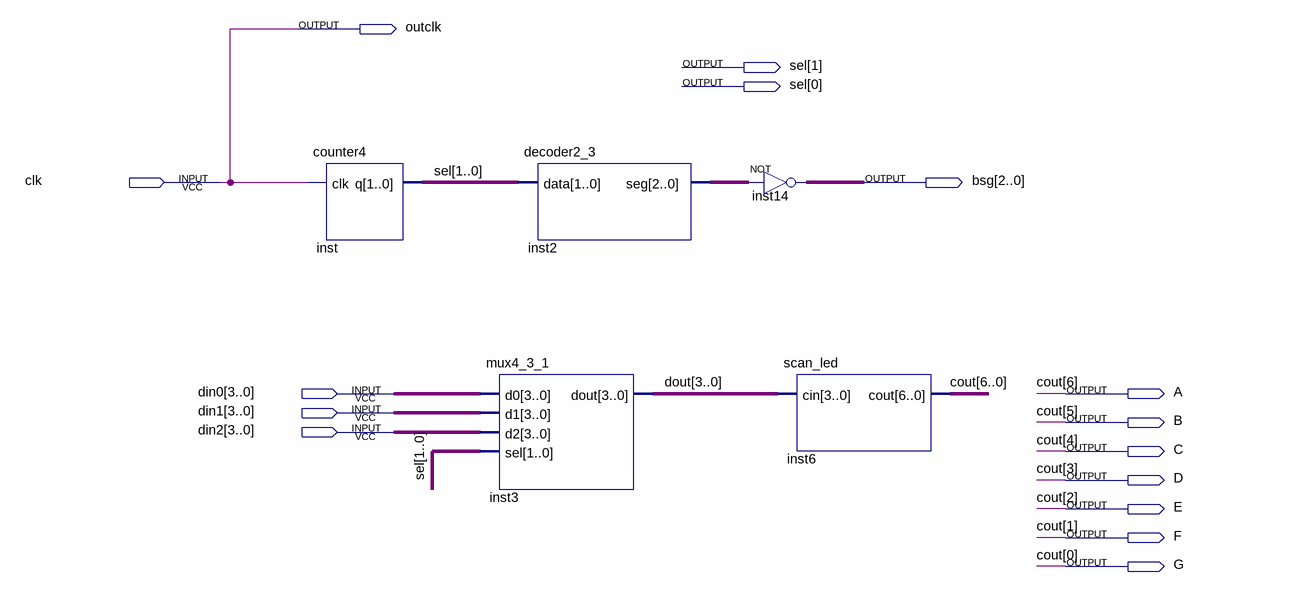
[diagram p0: schematic sheet]
// Quartus schematic scan_led3.bdf as structural Verilog: 5 symbols, 15 pins
module scan_led3 (
  input  clk,
  input  [3:0] din0,
  input  [3:0] din1,
  input  [3:0] din2,
  output outclk,
  output [1:0] sel,
  output [2:0] bsg,
  output A,
  output B,
  output C,
  output D,
  output E,
  output F,
  output G
);

  wire [2:0] inst2_seg;
  wire [3:0] dout;

  counter4 inst (.clk(clk), .q(sel));
  decoder2_3 inst2 (.data(sel), .seg(inst2_seg));
  mux4_3_1 inst3 (.d0(din0), .d1(din1), .d2(din2), .sel(sel), .dout(dout));
  assign bsg = ~inst2_seg;  // NOT inst14, 3 bits wide
  scan_led inst6 (.cin(dout), .cout({A, B, C, D, E, F, G}));

  assign outclk = clk;

  // Other names for the same wires on the sheet: cout[6:0] = {A, B, C, D, E, F, G}
endmodule
